# Altium schematic sheet 1000_RaspiHeader.SchDoc
size A3; SheetNumber: 2; SheetTotal: 4
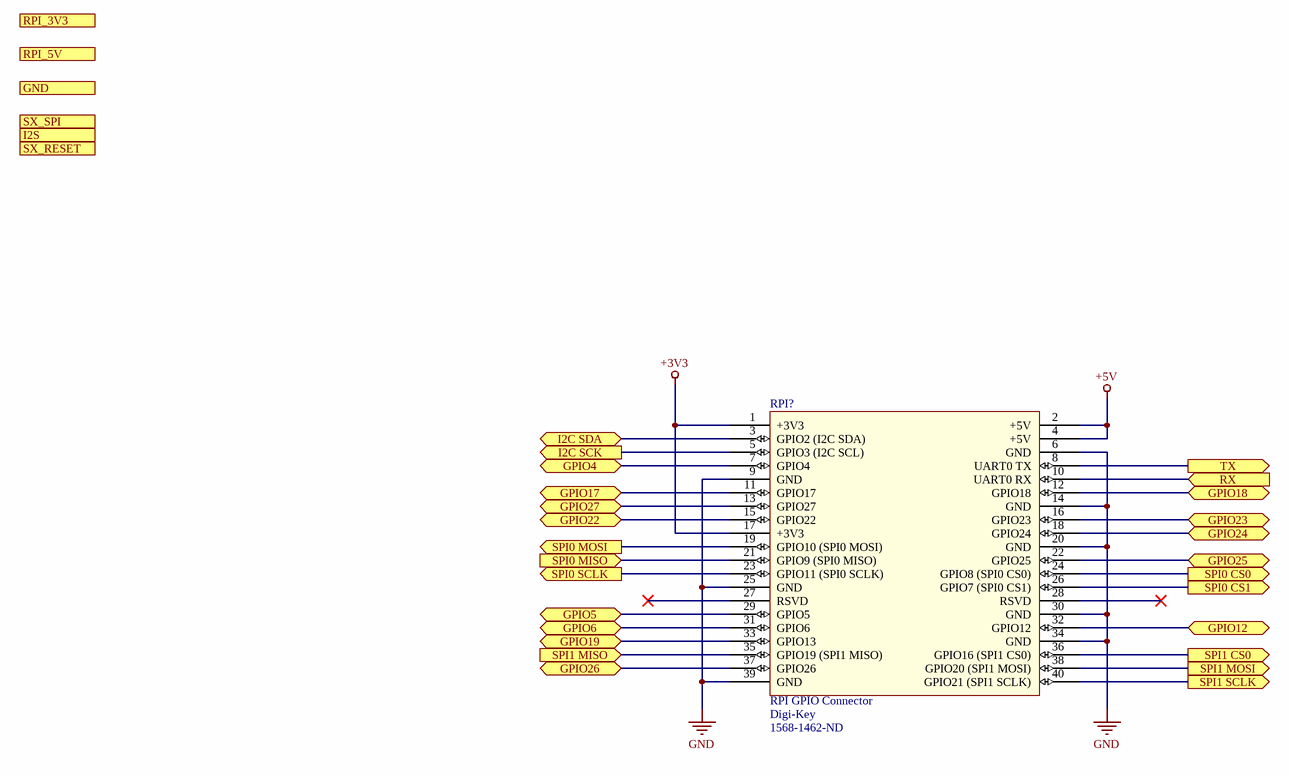
[diagram p0: 1000_RaspiHeader.SchDoc]

## Parts
RPI?  RPI GPIO Connector  Supplier 1: Digi-Key  Supplier Part Number 1: 1568-1462-ND  [rpi]

## Ports
GND, GPIO4 (bidir), GPIO5 (bidir), GPIO6 (bidir), GPIO12 (bidir), GPIO17 (bidir), GPIO18 (bidir), GPIO19 (bidir), GPIO22 (bidir), GPIO23 (bidir), GPIO24 (bidir), GPIO25 (bidir), GPIO26 (bidir), GPIO27 (bidir), I2C SCK (out), I2C SDA (bidir), I2S, RPI_3V3 (out), RPI_5V (out), RX (in), SPI0 CS0 (out), SPI0 CS1 (out), SPI0 MISO (in), SPI0 MOSI (out), SPI0 SCLK (out), SPI1 CS0 (out), SPI1 MISO (in), SPI1 MOSI (out), SPI1 SCLK (out), SX_RESET (out), SX_SPI, TX (out)

## Nets
+3V3: RPI?.1(+3V3) RPI?.17(+3V3)
+5V: RPI?.2(+5V) RPI?.4(+5V)
GND: RPI?.6(GND) RPI?.9(GND) RPI?.14(GND) RPI?.20(GND) RPI?.25(GND) RPI?.30(GND) RPI?.34(GND) RPI?.39(GND)
GPIO4: RPI?.7(GPIO4) ; port GPIO4
GPIO5: RPI?.29(GPIO5) ; port GPIO5
GPIO6: RPI?.31(GPIO6) ; port GPIO6
GPIO12: RPI?.32(GPIO12) ; port GPIO12
GPIO17: RPI?.11(GPIO17) ; port GPIO17
GPIO18: RPI?.12(GPIO18) ; port GPIO18
GPIO19: RPI?.33(GPIO13) ; port GPIO19
GPIO22: RPI?.15(GPIO22) ; port GPIO22
GPIO23: RPI?.16(GPIO23) ; port GPIO23
GPIO24: RPI?.18(GPIO24) ; port GPIO24
GPIO25: RPI?.22(GPIO25) ; port GPIO25
GPIO26: RPI?.37(GPIO26) ; port GPIO26
GPIO27: RPI?.13(GPIO27) ; port GPIO27
I2C SCK: RPI?.5(GPIO3_(I2C_SCL)) ; port I2C SCK
I2C SDA: RPI?.3(GPIO2_(I2C_SDA)) ; port I2C SDA
RX: RPI?.10(UART0_RX) ; port RX
SPI0 CS0: RPI?.24(GPIO8_(SPI0_CS0)) ; port SPI0 CS0
SPI0 CS1: RPI?.26(GPIO7_(SPI0_CS1)) ; port SPI0 CS1
SPI0 MISO: RPI?.21(GPIO9_(SPI0_MISO)) ; port SPI0 MISO
SPI0 MOSI: RPI?.19(GPIO10_(SPI0_MOSI)) ; port SPI0 MOSI
SPI0 SCLK: RPI?.23(GPIO11_(SPI0_SCLK)) ; port SPI0 SCLK
SPI1 CS0: RPI?.36(GPIO16_(SPI1_CS0)) ; port SPI1 CS0
SPI1 MISO: RPI?.35(GPIO19_(SPI1_MISO)) ; port SPI1 MISO
SPI1 MOSI: RPI?.38(GPIO20_(SPI1_MOSI)) ; port SPI1 MOSI
SPI1 SCLK: RPI?.40(GPIO21_(SPI1_SCLK)) ; port SPI1 SCLK
TX: RPI?.8(UART0_TX) ; port TX

Not connected (* = marked no-connect by the designer): RPI? 27(RSVD)* 28(RSVD)*

## Library data of the parts
RPI? = rpi connector: GPIO Header for Raspberry Pi A+/B+/Pi 2/Pi 3 - 2x20; Manufacturer: SparkFun Electronics; Manufacturer Part Number: PRT-14017; Nils Minor: author; nilsminor@web.de: mail; RoHS: RoHS Compliant; Category: Development Boards, Kits, Programmers; Stock 1: 150; Pricing 1: 1=1.84 (EUR); Part Status: Active; Accessory Type: Connector; For Use With/Related Products: Raspberry Pi; ComponentLink1URL: https://cdn.sparkfun.com/datasheets/Dev/RaspberryPi/12313.pdf; ComponentLink1Description: https://cdn.sparkfun.com/datasheets/Dev/RaspberryPi/12313.pdf